# Altium schematic sheet thvd8000.SchDoc
size A4; SheetNumber: 4; SheetTotal: 6
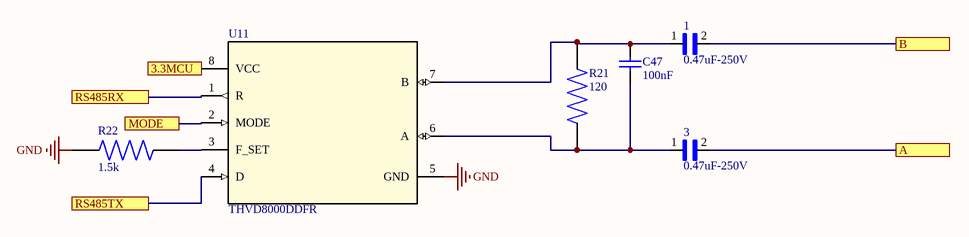
[diagram p0: thvd8000.SchDoc]

## Parts
1  0.47uF-250V  [CAPC3326X280N]
3  0.47uF-250V  [CAPC3326X280N]
C47  100nF  [CAPC3216X94X50ML20T25]
R21  120  [RES_ERA3AEB121V]
R22  1.5k  [RESC1608X55N]
U11  THVD8000DDFR  [DDF0008A-IPC_A]

## Ports
3.3MCU, A, B, MODE, RS485RX, RS485TX

## Nets
GND: R22.1 U11.5(GND)
3.3MCU: U11.8(VCC) ; port 3.3MCU
A: 3.2 ; port A
B: 1.2 ; port B
MODE: U11.2(MODE) ; port MODE
RS485RX: U11.1(R) ; port RS485RX
RS485TX: U11.4(D) ; port RS485TX
Net1_1: 1.1 C47.1 R21.2 U11.7(B)
Net3_1: 3.1 C47.2 R21.1 U11.6(A)
NetR22_2: R22.2 U11.3(F_SET)

## Library data of the parts
1 3 = CMP-010-000002-1: MF: {'manufacturer': u'KEMET'}; MP: C1210X474KARACAUTO; Value: *; Package: None; Price: None; Availability: Unavailable; Component Type: Standard; Design Item ID: C1210X474KARACAUTO; Pin Count: 2; Source: workerBoard.SCHLIB
C47 = CMP-003-000005-1: Chip Capacitor, Ceramic, 100 nF, 10%, 50 V, 1206, RoHS, Tape and Reel; Manufacturer: Kyocera AVX; Manufacturer Part Number: 12065C104KAT2A; Rated Voltage: 50V; Dielectric: X7R; Datasheet URL: http://www.mouser.com/ds/2/40/cauto-360.pdf; Capacitance: 100nF; Manufacturer URL: http://www.avx.com/; Datasheet Version: Sep-14; Tolerance (%): ±10%; Case Size/Dimension: 1206; Component Type: Standard; Design Item ID: CMP-2000-05018-1; Pin Count: 2; Source: workerBoard.SCHLIB
R21 = CMP-008-000000-1: MP: ERA3AEB121V; MF: {'manufacturer': u'Panasonic'}; Price: None; Availability: Unavailable; Value: *; Package: None; Component Type: Standard; Design Item ID: ERA3AEB121V; Pin Count: 2; Source: workerBoard.SCHLIB
R22 = CMP-008-000003-1: MP: RT0603BRD071K5L; MF: {'manufacturer': u'Yageo'}; Price: None; Availability: Unavailable; Value: *; Package: None; Component Type: Standard; Design Item ID: RT0603BRD071K5L; Pin Count: 2; Source: workerBoard.SCHLIB
U11 = CMP-010-000008-1: No Description Available; Mfr_Name: Texas Instruments; Type: DEV; RefDes: RefDes; Copyright: Copyright (C) 2021 Ultra Librarian. All rights reserved.; Manufacturer_Part_Number: THVD8000DDFR; Component Type: Standard; Design Item ID: THVD8000DDFR; Pin Count: 8; Source: workerBoard.SCHLIB